# Altium schematic sheet Display.SchDoc
size A4; SheetNumber: 4; SheetTotal: 7
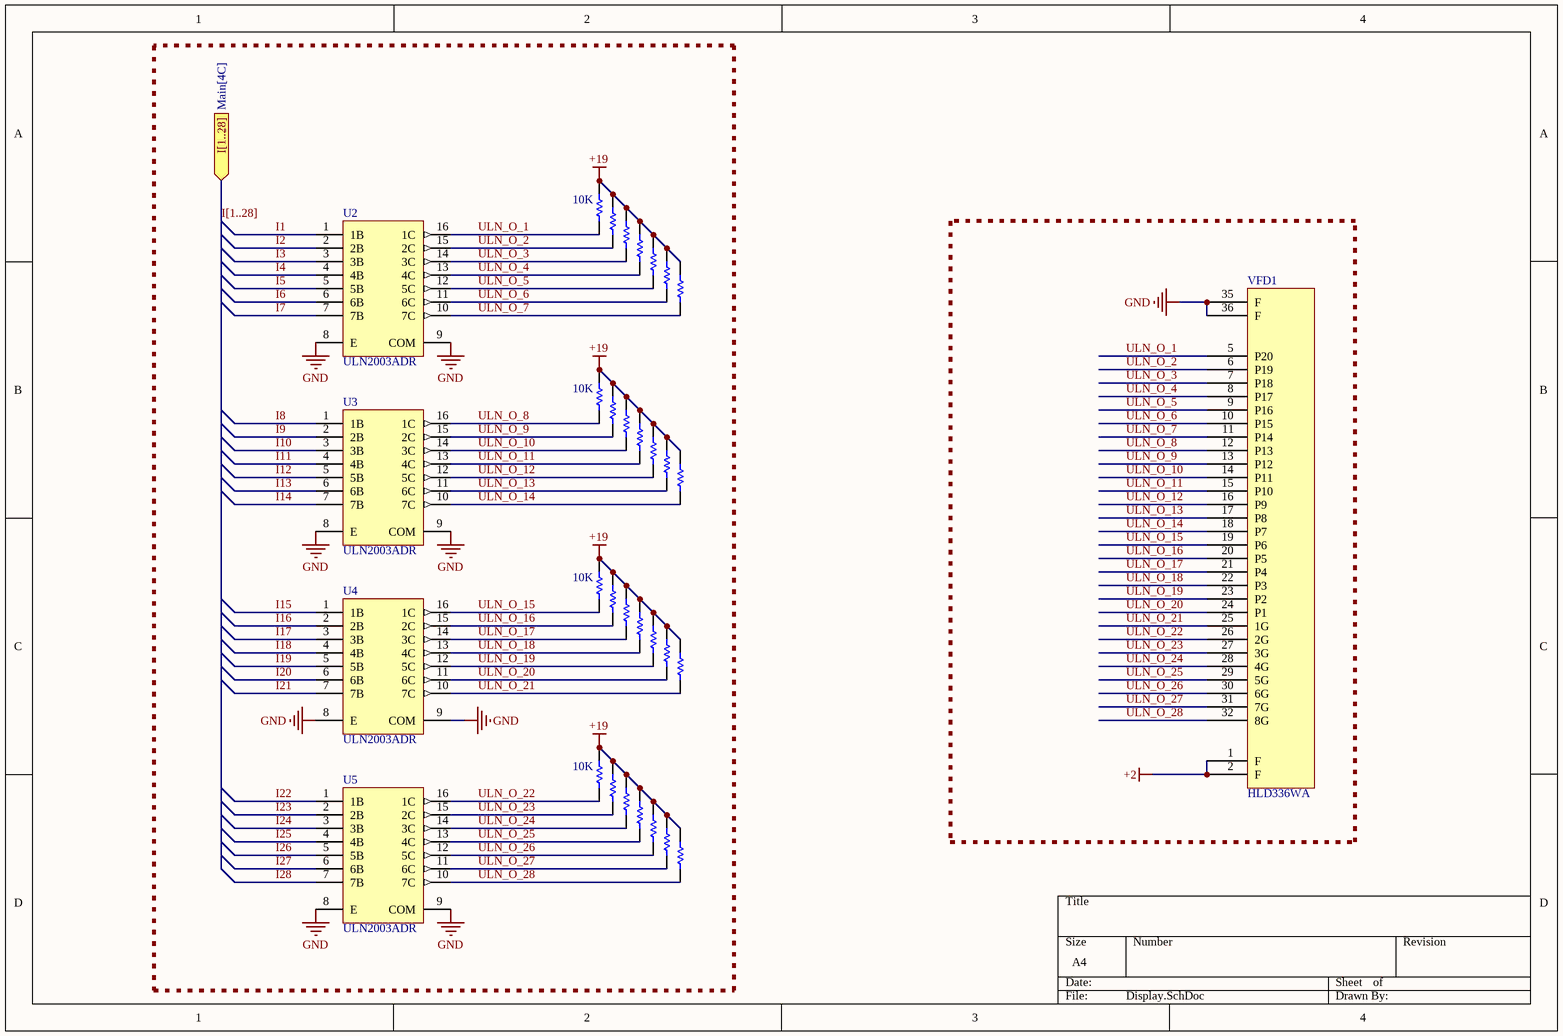
[diagram p0: Display.SchDoc]

## Parts
R4  10K  [RESC1609X50X30ML10T20]  (value not drawn)
R5  10K  [RESC1609X50X30ML10T20]
R6  10K  [RESC1609X50X30ML10T20]  (value not drawn)
R7  10K  [RESC1609X50X30ML10T20]  (value not drawn)
R8  10K  [RESC1609X50X30ML10T20]  (value not drawn)
R9  10K  [RESC1609X50X30ML10T20]  (value not drawn)
R10  10K  [RESC1609X50X30ML10T20]  (value not drawn)
R11  10K  [RESC1609X50X30ML10T20]  (value not drawn)
R12  10K  [RESC1609X50X30ML10T20]
R13  10K  [RESC1609X50X30ML10T20]  (value not drawn)
R14  10K  [RESC1609X50X30ML10T20]  (value not drawn)
R15  10K  [RESC1609X50X30ML10T20]  (value not drawn)
R16  10K  [RESC1609X50X30ML10T20]  (value not drawn)
R17  10K  [RESC1609X50X30ML10T20]  (value not drawn)
R18  10K  [RESC1609X50X30ML10T20]  (value not drawn)
R19  10K  [RESC1609X50X30ML10T20]
R20  10K  [RESC1609X50X30ML10T20]  (value not drawn)
R21  10K  [RESC1609X50X30ML10T20]  (value not drawn)
R22  10K  [RESC1609X50X30ML10T20]  (value not drawn)
R23  10K  [RESC1609X50X30ML10T20]  (value not drawn)
R24  10K  [RESC1609X50X30ML10T20]  (value not drawn)
R25  10K  [RESC1609X50X30ML10T20]
R26  10K  [RESC1609X50X30ML10T20]  (value not drawn)
R27  10K  [RESC1609X50X30ML10T20]  (value not drawn)
R28  10K  [RESC1609X50X30ML10T20]  (value not drawn)
R29  10K  [RESC1609X50X30ML10T20]  (value not drawn)
R30  10K  [RESC1609X50X30ML10T20]  (value not drawn)
R31  10K  [RESC1609X50X30ML10T20]  (value not drawn)
U2  ULN2003ADR  [D0016A_M]
U3  ULN2003ADR  [D0016A_M]
U4  ULN2003ADR  [D0016A_M]
U5  ULN2003ADR  [D0016A_M]
VFD1  HLD336WA  [DIP72]

## Ports
I[1..28] (in, see Main[4C])

## Nets
+2: VFD1.1(F) VFD1.2(F)
+19: R4.1 R5.1 R6.1 R7.1 R8.1 R9.1 R10.1 R11.1 R12.1 R13.1 R14.1 R15.1 R16.1 R17.1 R18.1 R19.1 R20.1 R21.1 R22.1 R23.1 R24.1 R25.1 R26.1 R27.1 R28.1 R29.1 R30.1 R31.1
GND: U2.8(E) U2.9(COM) U3.8(E) U3.9(COM) U4.8(E) U4.9(COM) U5.8(E) U5.9(COM) VFD1.35(F) VFD1.36(F)
I1: U2.1(1B)
I2: U2.2(2B)
I3: U2.3(3B)
I4: U2.4(4B)
I5: U2.5(5B)
I6: U2.6(6B)
I7: U2.7(7B)
I8: U3.1(1B)
I9: U3.2(2B)
I10: U3.3(3B)
I11: U3.4(4B)
I12: U3.5(5B)
I13: U3.6(6B)
I14: U3.7(7B)
I15: U4.1(1B)
I16: U4.2(2B)
I17: U4.3(3B)
I18: U4.4(4B)
I19: U4.5(5B)
I20: U4.6(6B)
I21: U4.7(7B)
I22: U5.1(1B)
I23: U5.2(2B)
I24: U5.3(3B)
I25: U5.4(4B)
I26: U5.5(5B)
I27: U5.6(6B)
I28: U5.7(7B)
ULN_O_1: R5.2 U2.16(1C) VFD1.5(P20)
ULN_O_2: R6.2 U2.15(2C) VFD1.6(P19)
ULN_O_3: R7.2 U2.14(3C) VFD1.7(P18)
ULN_O_4: R8.2 U2.13(4C) VFD1.8(P17)
ULN_O_5: R9.2 U2.12(5C) VFD1.9(P16)
ULN_O_6: R10.2 U2.11(6C) VFD1.10(P15)
ULN_O_7: R11.2 U2.10(7C) VFD1.11(P14)
ULN_O_8: R12.2 U3.16(1C) VFD1.12(P13)
ULN_O_9: R13.2 U3.15(2C) VFD1.13(P12)
ULN_O_10: R14.2 U3.14(3C) VFD1.14(P11)
ULN_O_11: R15.2 U3.13(4C) VFD1.15(P10)
ULN_O_12: R16.2 U3.12(5C) VFD1.16(P9)
ULN_O_13: R17.2 U3.11(6C) VFD1.17(P8)
ULN_O_14: R18.2 U3.10(7C) VFD1.18(P7)
ULN_O_15: R19.2 U4.16(1C) VFD1.19(P6)
ULN_O_16: R20.2 U4.15(2C) VFD1.20(P5)
ULN_O_17: R21.2 U4.14(3C) VFD1.21(P4)
ULN_O_18: R22.2 U4.13(4C) VFD1.22(P3)
ULN_O_19: R23.2 U4.12(5C) VFD1.23(P2)
ULN_O_20: R24.2 U4.11(6C) VFD1.24(P1)
ULN_O_21: R4.2 U4.10(7C) VFD1.25(1G)
ULN_O_22: R25.2 U5.16(1C) VFD1.26(2G)
ULN_O_23: R26.2 U5.15(2C) VFD1.27(3G)
ULN_O_24: R27.2 U5.14(3C) VFD1.28(4G)
ULN_O_25: R28.2 U5.13(4C) VFD1.29(5G)
ULN_O_26: R29.2 U5.12(5C) VFD1.30(6G)
ULN_O_27: R30.2 U5.11(6C) VFD1.31(7G)
ULN_O_28: R31.2 U5.10(7C) VFD1.32(8G)

## Buses and harness runs
bus I[1..28] = port I[1..28]

## Library data of the parts
R4-R31 = CMP-2000-03837-1: Manufacturer: Vishay Dale; Part Number: CRCW060310K0FKTB
U2-U5 = CMP-2000-04953-1: High-Voltage, High-Current Darlington Transistor Array, 0.5 A, 50 V, -20 to 70 degC, 16-Pin SOIC (D), Green (RoHS & no Sb/Br), Tape and Reel; Manufacturer: TexasInstruments; Peak DC Collector Current: 0.5A; Package Version: 4040047-6/M, 06/2011; Maximum Collector Emitter Voltage: 50V; Configuration: Array7; Maximum Collector Emitter Saturation Voltage: 1.1@100mA; Rad Hard: No; Packaging: Tape&Reel; Datasheet URL: http://www.ti.com/general/docs/lit/getliterature.tsp?genericPartNumber=uln2003a&fileType=pdf; Package Reference: D16; Category: DarlingtonBJT; Datasheet Version: Rev. O, 01/2016; Manufacturer URL: http://www.ti.com/; Type: NPN; Package Description: 16-Pin Plastic Small Outline, Body 9.9 x 3.9 mm, Pitch 1.27 mm; Mounting: SurfaceMount; Package: 16SOIC; Package URL: http://www.ti.com/lit/ml/mpds178g/mpds178g.pdf